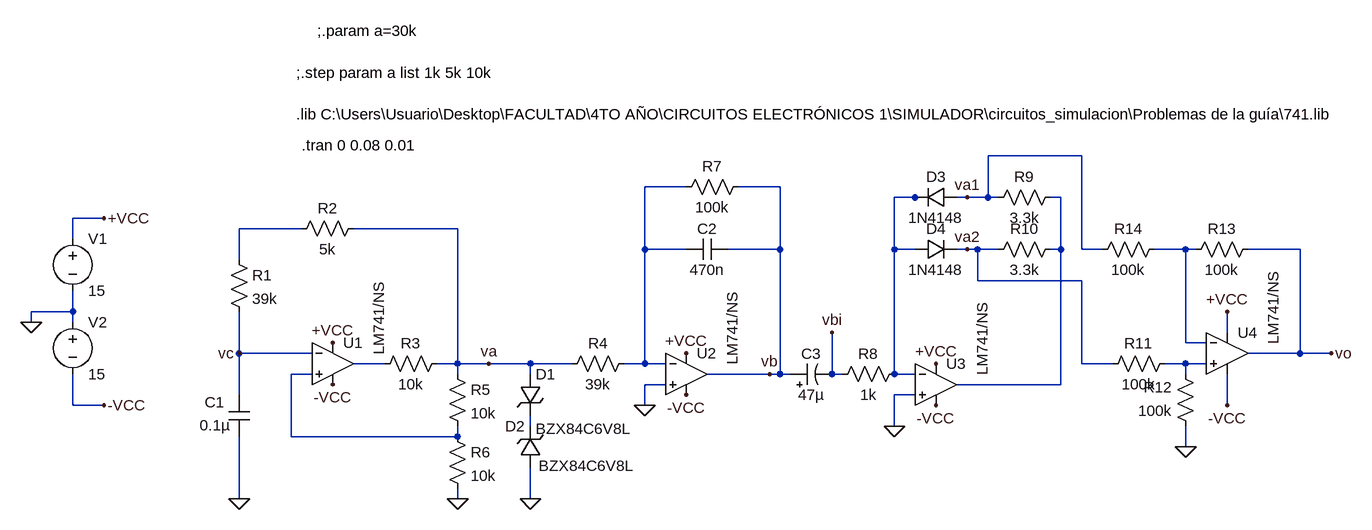
[diagram p0: schematic lab3.asc]
lab3.asc, the LTspice schematic file:
Version 4
SHEET 1 1292 764
WIRE 752 -144 608 -144
WIRE 144 -96 80 -96
WIRE 288 -96 224 -96
WIRE 496 -80 464 -80
WIRE 512 -80 496 -80
WIRE 576 -80 560 -80
WIRE 608 -80 608 -144
WIRE 608 -80 576 -80
WIRE 624 -80 608 -80
WIRE 720 -80 704 -80
WIRE -752 -48 -800 -48
WIRE -448 -32 -544 -32
WIRE -208 -32 -368 -32
WIRE -800 -16 -800 -48
WIRE 80 0 80 -96
WIRE 144 0 80 0
WIRE 288 0 288 -96
WIRE 288 0 208 0
WIRE 464 0 464 -80
WIRE 496 0 464 0
WIRE 576 0 560 0
WIRE 592 0 576 0
WIRE 624 0 592 0
WIRE 720 0 720 -80
WIRE 720 0 704 0
WIRE 752 0 752 -144
WIRE 784 0 752 0
WIRE 912 0 864 0
WIRE 928 0 912 0
WIRE 1088 0 1008 0
WIRE -544 16 -544 -32
WIRE 592 48 592 0
WIRE 752 48 592 48
WIRE -800 96 -800 64
WIRE -800 96 -864 96
WIRE -864 112 -864 96
WIRE -800 112 -800 96
WIRE 976 128 976 96
WIRE 912 144 912 0
WIRE 944 144 912 144
WIRE -544 160 -544 96
WIRE -432 160 -544 160
WIRE 1088 160 1088 0
WIRE 1088 160 1008 160
WIRE 1136 160 1088 160
WIRE -320 176 -368 176
WIRE -208 176 -208 -32
WIRE -208 176 -240 176
WIRE -160 176 -208 176
WIRE -96 176 -160 176
WIRE -32 176 -96 176
WIRE 80 176 80 0
WIRE 80 176 48 176
WIRE 112 176 80 176
WIRE 752 176 752 48
WIRE 800 176 752 176
WIRE 912 176 880 176
WIRE 944 176 912 176
WIRE -432 192 -464 192
WIRE -208 192 -208 176
WIRE -96 192 -96 176
WIRE 272 192 176 192
WIRE 288 192 288 0
WIRE 288 192 272 192
WIRE 304 192 288 192
WIRE 368 192 368 128
WIRE 384 192 368 192
WIRE 464 192 464 0
WIRE 496 192 464 192
WIRE 912 192 912 176
WIRE 112 208 80 208
WIRE 720 208 720 0
WIRE 720 208 560 208
WIRE -544 224 -544 160
WIRE 496 224 464 224
WIRE -800 240 -800 192
WIRE -752 240 -800 240
WIRE 80 240 80 208
WIRE 976 240 976 192
WIRE -96 272 -96 256
WIRE 464 272 464 224
WIRE -464 288 -464 192
WIRE -208 288 -208 272
WIRE -208 288 -464 288
WIRE 912 304 912 272
WIRE -544 384 -544 288
WIRE -208 384 -208 368
WIRE -96 384 -96 336
FLAG -864 112 0
FLAG -752 240 -VCC
FLAG -400 208 -VCC
FLAG 144 224 -VCC
FLAG 528 240 -VCC
FLAG 976 240 -VCC
FLAG -752 -48 +VCC
FLAG -400 144 +VCC
FLAG 144 160 +VCC
FLAG 528 176 +VCC
FLAG 976 96 +VCC
FLAG -544 384 0
FLAG 80 240 0
FLAG -208 384 0
FLAG -96 384 0
FLAG -544 160 vc
FLAG 464 272 0
FLAG -160 176 va
FLAG 272 192 vb
FLAG 368 128 vbi
FLAG 912 304 0
FLAG 1136 160 vo
FLAG 576 -80 va1
FLAG 576 0 va2
SYMBOL OpAmps\\opamp2 -400 112 R0
WINDOW 3 71 50 VLeft 2
SYMATTR Value LM741/NS
SYMATTR InstName U1
SYMBOL OpAmps\\opamp2 144 128 R0
WINDOW 3 71 50 VLeft 2
SYMATTR Value LM741/NS
SYMATTR InstName U2
SYMBOL OpAmps\\opamp2 528 144 R0
WINDOW 3 71 50 VLeft 2
SYMATTR Value LM741/NS
SYMATTR InstName U3
SYMBOL OpAmps\\opamp2 976 96 R0
WINDOW 3 71 50 VLeft 2
SYMATTR Value LM741/NS
SYMATTR InstName U4
SYMBOL voltage -800 -32 R0
WINDOW 123 0 0 Left 0
WINDOW 39 0 0 Left 0
SYMATTR InstName V1
SYMATTR Value 15
SYMBOL voltage -800 96 R0
WINDOW 123 0 0 Left 0
WINDOW 39 0 0 Left 0
SYMATTR InstName V2
SYMATTR Value 15
SYMBOL cap -560 224 R0
WINDOW 0 -37 11 Left 2
WINDOW 3 -45 47 Left 2
SYMATTR InstName C1
SYMATTR Value 0.1µ
SYMBOL cap 208 -16 R90
WINDOW 0 0 32 VBottom 2
WINDOW 3 32 32 VTop 2
SYMATTR InstName C2
SYMATTR Value 470n
SYMBOL res -560 0 R0
SYMATTR InstName R1
SYMATTR Value 39k
SYMBOL res -352 -48 R90
WINDOW 0 0 56 VBottom 2
WINDOW 3 32 56 VTop 2
SYMATTR InstName R2
SYMATTR Value 5k
SYMBOL res -224 160 R90
WINDOW 0 0 56 VBottom 2
WINDOW 3 32 56 VTop 2
SYMATTR InstName R3
SYMATTR Value 10k
SYMBOL res 64 160 R90
WINDOW 0 0 56 VBottom 2
WINDOW 3 32 56 VTop 2
SYMATTR InstName R4
SYMATTR Value 39k
SYMBOL res -224 176 R0
SYMATTR InstName R5
SYMATTR Value 10k
SYMBOL res -224 272 R0
SYMATTR InstName R6
SYMATTR Value 10k
SYMBOL res 240 -112 R90
WINDOW 0 0 56 VBottom 2
WINDOW 3 32 56 VTop 2
SYMATTR InstName R7
SYMATTR Value 100k
SYMBOL zener -112 192 R0
WINDOW 3 24 84 Left 2
SYMATTR InstName D1
SYMATTR Value BZX84C6V8L
SYMBOL zener -80 336 R180
WINDOW 0 24 64 Left 2
WINDOW 3 -144 3 Left 2
SYMATTR InstName D2
SYMATTR Value BZX84C6V8L
SYMBOL polcap 304 208 R270
WINDOW 0 32 32 VTop 2
WINDOW 3 0 32 VBottom 2
SYMATTR InstName C3
SYMATTR Value 47µ
SYMATTR Description Capacitor
SYMATTR Type cap
SYMATTR SpiceLine V=10 Irms=48m Rser=0.811055 Lser=4.07033n mfg="Würth Elektronik" pn="865230243003 WCAP-AS5H 6,3x5,5" type="Al electrolytic"
SYMBOL res 480 176 R90
WINDOW 0 0 56 VBottom 2
WINDOW 3 32 56 VTop 2
SYMATTR InstName R8
SYMATTR Value 1k
SYMBOL diode 560 -96 R90
WINDOW 0 0 32 VBottom 2
WINDOW 3 32 32 VTop 2
SYMATTR InstName D3
SYMATTR Value 1N4148
SYMBOL diode 496 16 R270
WINDOW 0 32 32 VTop 2
WINDOW 3 0 32 VBottom 2
SYMATTR InstName D4
SYMATTR Value 1N4148
SYMBOL res 720 -96 R90
WINDOW 0 0 56 VBottom 2
WINDOW 3 32 56 VTop 2
SYMATTR InstName R9
SYMATTR Value 3.3k
SYMBOL res 720 -16 R90
WINDOW 0 0 56 VBottom 2
WINDOW 3 32 56 VTop 2
SYMATTR InstName R10
SYMATTR Value 3.3k
SYMBOL res 896 160 R90
WINDOW 0 0 56 VBottom 2
WINDOW 3 32 56 VTop 2
SYMATTR InstName R11
SYMATTR Value 100k
SYMBOL res 928 288 R180
WINDOW 0 36 76 Left 2
WINDOW 3 36 40 Left 2
SYMATTR InstName R12
SYMATTR Value 100k
SYMBOL res 912 16 R270
WINDOW 0 32 56 VTop 2
WINDOW 3 0 56 VBottom 2
SYMATTR InstName R13
SYMATTR Value 100k
SYMBOL res 768 16 R270
WINDOW 0 32 56 VTop 2
WINDOW 3 0 56 VBottom 2
SYMATTR InstName R14
SYMATTR Value 100k
TEXT -456 -208 Left 2 !.lib C:\\Users\\Usuario\\Desktop\\FACULTAD\\4TO AÑO\\CIRCUITOS ELECTRÓNICOS 1\\SIMULADOR\\circuitos_simulacion\\Problemas de la guía\\741.lib
TEXT -424 -336 Left 2 !;.param a=30k
TEXT -456 -272 Left 2 !;.step param a list 1k 5k 10k
TEXT -448 -160 Left 2 !.tran 0 0.08 0.01

The netlist it stands for:
* lab3.asc
XU1 N008 vc +VCC -VCC N006 LM741/NS  ; pins In+ In- V+ V- OUT
XU2 0 N001 +VCC -VCC vb LM741/NS  ; pins In+ In- V+ V- OUT
XU3 0 N002 +VCC -VCC N003 LM741/NS  ; pins In+ In- V+ V- OUT
XU4 N007 N005 +VCC -VCC vo LM741/NS  ; pins In+ In- V+ V- OUT
V1 +VCC 0 15
V2 0 -VCC 15
C1 vc 0 0.1µ
C2 vb N001 470n
R1 N004 vc 39k
R2 va N004 5k
R3 va N006 10k
R4 N001 va 39k
R5 va N008 10k
R6 N008 0 10k
R7 vb N001 100k
D1 va N009 BZX84C6V8L
D2 0 N009 BZX84C6V8L
C3 vb vbi 47µ V=10 Irms=48m Rser=0.811055 Lser=4.07033n mfg="Würth Elektronik" pn="865230243003 WCAP-AS5H 6,3x5,5" type="Al electrolytic"
R8 N002 vbi 1k
D3 va1 N002 1N4148
D4 N002 va2 1N4148
R9 N003 va1 3.3k
R10 N003 va2 3.3k
R11 N007 va2 100k
R12 0 N007 100k
R13 N005 vo 100k
R14 va1 N005 100k
.model D D
.lib standard.dio
.lib C:\Users\Usuario\Desktop\FACULTAD\4TO AÑO\CIRCUITOS ELECTRÓNICOS 1\SIMULADOR\circuitos_simulacion\Problemas de la guía\741.lib
;.param a=30k
;.step param a list 1k 5k 10k
.tran 0 0.08 0.01
.backanno
.end